# Altium schematic sheet MCU_Headers.SchDoc
size A; SheetNumber: 8; SheetTotal: 8
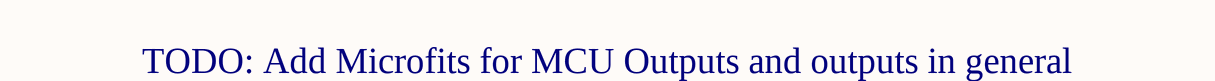
[diagram p0: MCU_Headers.SchDoc]

## Notes on the sheet
- TODO: Add Microfits for MCU Outputs and outputs in general